# Altium schematic sheet LED.SchDoc
size 420 x 297 mm; SheetNumber: 13; SheetTotal: 21
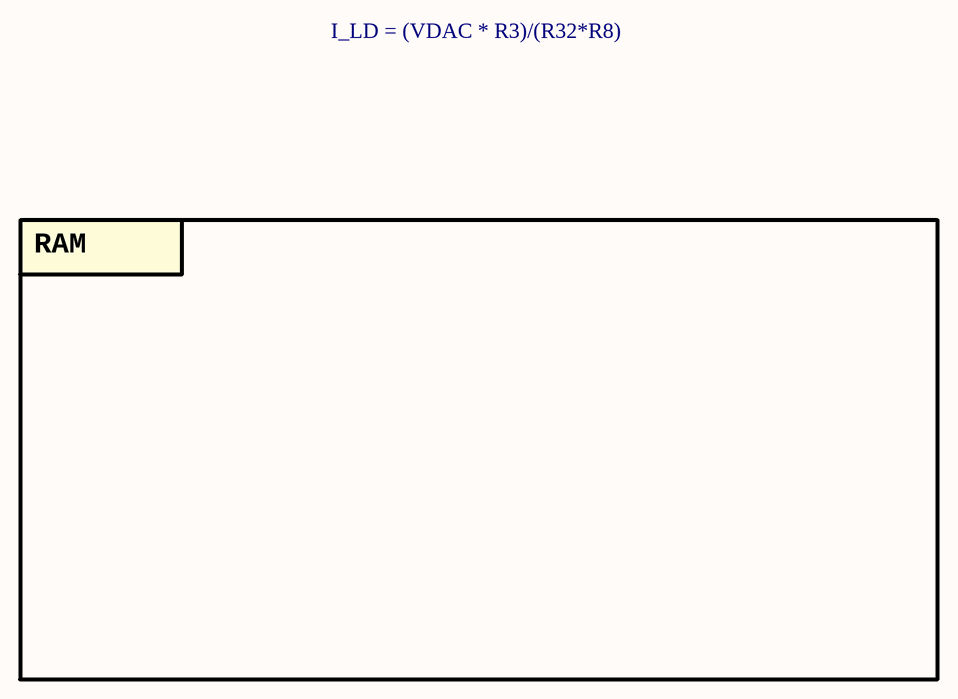
[diagram p0: LED.SchDoc]

## Notes on the sheet
- I_LD = (VDAC * R3)/(R32*R8)
- RAM
- Project:
- Sub-system:
- Design by:
- Sheet title:
- Sheet
- of
- Checked by:
- Approved by:
- Revision:
- Document No:
- Size:
- Date:
- A3